# Altium schematic sheet MicroSDCard.SchDoc
size A4; Author: Michał Kowalik; CompanyName: AGH Racing; DocumentNumber: 2; Revision: 2.1; SheetNumber: 2; SheetTotal: 11; CarNumber: 5; ProjectName: Project Name
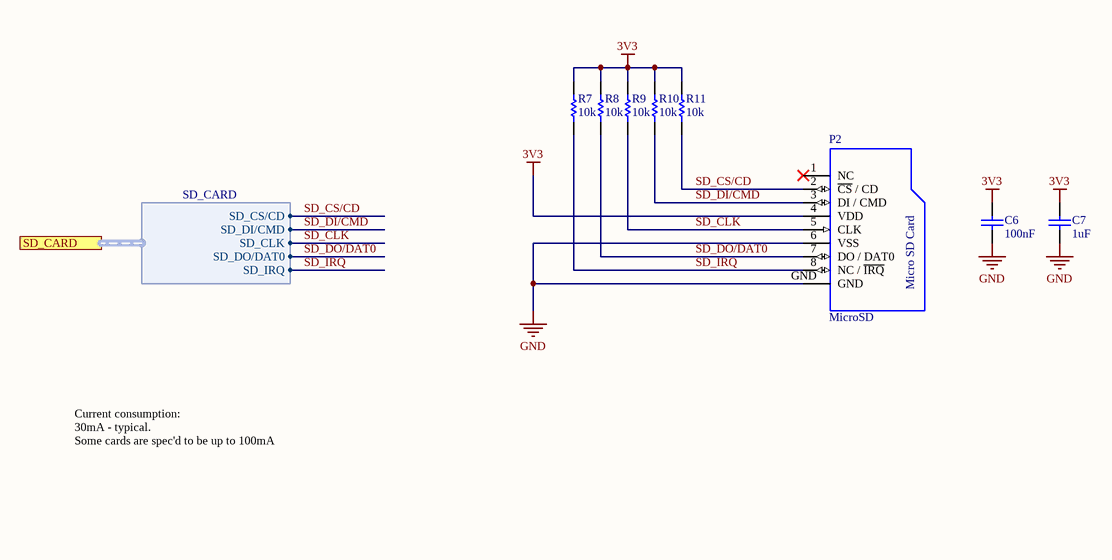
[diagram p0: MicroSDCard.SchDoc]

## Parts
C6  value 100nF  [CAP_0603_IPC_MD]  (hidden comment: Cap)
C7  value 1uF  [CAP_0603_IPC_MD]  (hidden comment: Cap)
P2  MicroSD  [MICROSDCARD_SOCKET]
R7  value 10k  [RES_0603_IPC_MD]  (hidden comment: Res)
R8  value 10k  [RES_0603_IPC_MD]  (hidden comment: Res)
R9  value 10k  [RES_0603_IPC_MD]  (hidden comment: Res)
R10  value 10k  [RES_0603_IPC_MD]  (hidden comment: Res)
R11  value 10k  [RES_0603_IPC_MD]  (hidden comment: Res)

## Ports
SD_CARD (harness SD_CARD)

## Harnesses
SD_CARD: SD_CS/CD, SD_DI/CMD, SD_CLK, SD_DO/DAT0, SD_IRQ

## Nets
3V3: C6.2 C7.2 P2.4(VDD) R7.2 R8.2 R9.2 R10.2 R11.2
GND: C6.1 C7.1 P2.6(VSS) P2.GND
SD_CLK: P2.5(CLK) R9.1 ; port SD_CARD.SD_CLK
SD_CS/CD: P2.2(~{CS}_/_CD) R11.1 ; port SD_CARD.SD_CS/CD
SD_DI/CMD: P2.3(DI_/_CMD) R10.1 ; port SD_CARD.SD_DI/CMD
SD_DO/DAT0: P2.7(DO_/_DAT0) R8.1 ; port SD_CARD.SD_DO/DAT0
SD_IRQ: P2.8(NC_/_~{IRQ}) R7.1 ; port SD_CARD.SD_IRQ

Not connected (* = marked no-connect by the designer): P2 1(NC)*

## Notes on the sheet
- Current consumption:
  30mA - typical.
  Some cards are spec'd to be up to 100mA
- Confidential / Not for distribution !
- Project name:
- Document name:
- Sheet:
- Car No.
- of
- Designer Name:
- Date/Time:
- Revision:
- (in symbol MicroSD) Micro SD Card

## Library data of the parts
C6 C7 = Cap: Capacitor
P2 = MicroSD: Micro SD Card Connector
R7-R11 = Res: Resistor